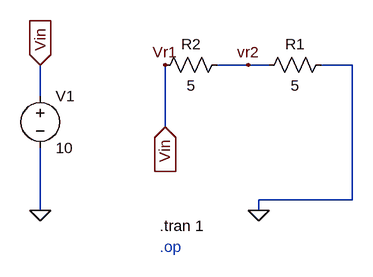
[diagram p0: schematic basicCircuit.asc]
basicCircuit.asc, the LTspice schematic file:
Version 4
SHEET 1 880 680
WIRE 272 96 224 96
WIRE 304 96 272 96
WIRE 432 96 384 96
WIRE -48 144 -48 96
WIRE 144 192 144 96
WIRE 432 304 432 96
WIRE 432 304 288 304
WIRE -48 320 -48 224
WIRE 288 320 288 304
FLAG 288 320 0
FLAG 144 96 Vr1
FLAG 272 96 vr2
FLAG -48 320 0
FLAG -48 96 Vin
IOPIN -48 96 In
FLAG 144 192 Vin
IOPIN 144 192 In
SYMBOL res 240 80 R90
WINDOW 0 0 56 VBottom 2
WINDOW 3 32 56 VTop 2
SYMATTR InstName R2
SYMATTR Value 5
SYMBOL res 400 80 R90
WINDOW 0 0 56 VBottom 2
WINDOW 3 32 56 VTop 2
SYMATTR InstName R1
SYMATTR Value 5
SYMBOL voltage -48 128 R0
WINDOW 123 0 0 Left 0
WINDOW 39 0 0 Left 0
SYMATTR InstName V1
SYMATTR Value 10
TEXT 136 344 Left 2 !.tran 1
TEXT 136 376 Left 2 ;.op

The netlist it stands for:
* basicCircuit.asc
R2 vr2 Vin 5
R1 0 vr2 5
V1 Vin 0 10
.tran 1
* .op
.backanno
.end